# Altium project shepherd_v2.PrjPcb
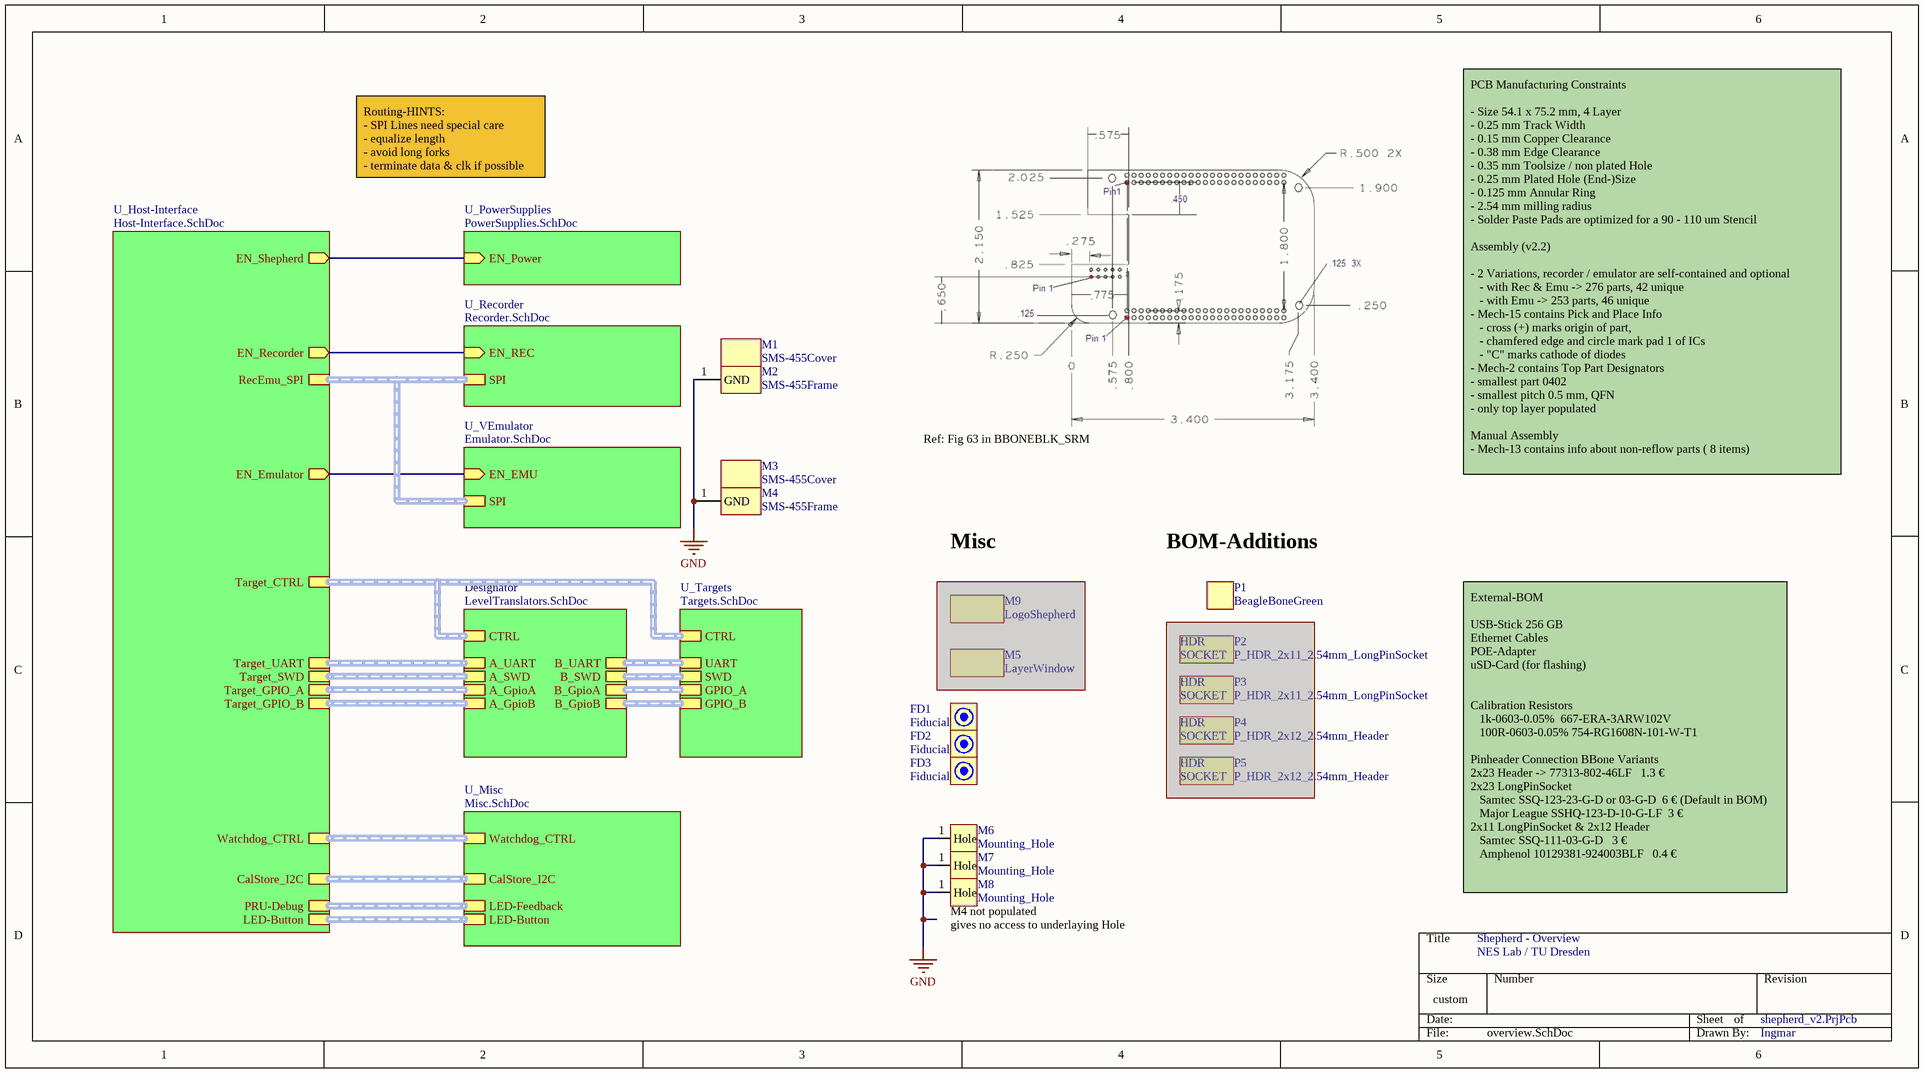
[diagram p0: overview.SchDoc]
3 sheets, 106 parts. Net scope: hierarchical (ports join the sheet entries above them; power ports are global).
Board file: shepherd_pcb_v2.2.PcbDoc
Sheets:
  overview.SchDoc
    U_Recorder = Recorder.SchDoc
    U_Targets = Targets.SchDoc

## Sheet overview.SchDoc: Shepherd - Overview
size 359 x 199 mm; Author: Ingmar; CompanyName: NES Lab / TU Dresden; Organization: NES Lab / TU Dresden; DocumentNumber: 1; SheetNumber: 1; SheetTotal: 8

### Parts
FD1  Fiducial  [M_Fiducial_3mm]  (no BOM)
FD2  Fiducial  [M_Fiducial_3mm]  (no BOM)
FD3  Fiducial  [M_Fiducial_3mm]  (no BOM)
M1  SMS-455Cover  (mechanical)
M2  SMS-455Frame  [SMS-455F]
M3  SMS-455Cover  (mechanical)
M4  SMS-455Frame  [SMS-455F]
M5  LayerWindow  [LayerWindow_4L_EC_conform_B]  (no BOM)  (masked out: inside a compile mask, not in the netlist)
M6  Mounting_Hole  [M_Mountinghole_3.2mm]  (no BOM)
M7  Mounting_Hole  [M_Mountinghole_3.2mm_min]  (no BOM)
M8  Mounting_Hole  [M_Mountinghole_3.2mm_min]  (no BOM)
M9  LogoShepherd  [LogoShepherd]  (no BOM)  (masked out: inside a compile mask, not in the netlist)
P1  BeagleBoneGreen  (mechanical)
P2  P_HDR_2x11_2.54mm_LongPinSocket  (mechanical)  (masked out: inside a compile mask, not in the netlist)
P3  P_HDR_2x11_2.54mm_LongPinSocket  (mechanical)  (masked out: inside a compile mask, not in the netlist)
P4  P_HDR_2x12_2.54mm_Header  (mechanical)  (masked out: inside a compile mask, not in the netlist)
P5  P_HDR_2x12_2.54mm_Header  (mechanical)  (masked out: inside a compile mask, not in the netlist)

### Sub-sheets
Designator = LevelTranslators.SchDoc (file not in this document): CTRL (harness GPIO), A_GpioA (harness GPIO), B_GpioA (harness GPIO), A_UART (harness UART), A_GpioB (harness GPIO), B_SWD (harness SWD), B_UART (harness UART), B_GpioB (harness GPIO), A_SWD (harness SWD)
U_Host-Interface = Host-Interface.SchDoc (file not in this document): RecEmu_SPI (harness SPI), Target_UART (harness UART), Target_SWD (harness SWD), CalStore_I2C (harness I2C), PRU-Debug (harness GPIO), Watchdog_CTRL (harness Watchdog), EN_Shepherd (out), LED-Button (harness GPIO), Target_CTRL (harness GPIO), Target_GPIO_A (harness GPIO), Target_GPIO_B (harness GPIO), EN_Recorder (out), EN_Emulator (out)
U_Misc = Misc.SchDoc (file not in this document): CalStore_I2C (harness I2C), LED-Feedback (harness GPIO), Watchdog_CTRL (harness Watchdog), LED-Button (harness GPIO)
U_PowerSupplies = PowerSupplies.SchDoc (file not in this document): EN_Power (in)
U_Recorder = Recorder.SchDoc: SPI (harness SPI), EN_REC (in)
U_Targets = Targets.SchDoc: UART (harness UART), SWD (harness SWD), CTRL (harness GPIO), GPIO_A (harness GPIO), GPIO_B (harness GPIO)
U_VEmulator = Emulator.SchDoc (file not in this document): SPI (harness SPI), EN_EMU (in)

### Nets
GND: M2.1(GND) M4.1(GND) M6.1(Hole) M7.1(Hole) M8.1(Hole)
~{RST}_rADC: sheet U_Host-Interface/EN_Recorder, sheet U_Recorder/EN_REC
(unnamed): sheet U_Host-Interface/EN_Shepherd, sheet U_PowerSupplies/EN_Power
(unnamed): sheet U_Host-Interface/EN_Emulator, sheet U_VEmulator/EN_EMU

### Buses and harness runs
harness sheet Designator/A_GpioA = sheet U_Host-Interface/Target_GPIO_A
harness sheet Designator/A_GpioB = sheet U_Host-Interface/Target_GPIO_B
harness sheet Designator/A_SWD = sheet U_Host-Interface/Target_SWD
harness sheet Designator/A_UART = sheet U_Host-Interface/Target_UART
harness sheet Designator/B_GpioA = sheet U_Targets/GPIO_A
harness sheet Designator/B_GpioB = sheet U_Targets/GPIO_B
harness sheet Designator/B_SWD = sheet U_Targets/SWD
harness sheet Designator/B_UART = sheet U_Targets/UART
harness sheet Designator/CTRL = sheet U_Host-Interface/Target_CTRL = sheet U_Targets/CTRL
harness sheet U_Host-Interface/CalStore_I2C = sheet U_Misc/CalStore_I2C
harness sheet U_Host-Interface/LED-Button = sheet U_Misc/LED-Button
harness sheet U_Host-Interface/PRU-Debug = sheet U_Misc/LED-Feedback
harness sheet U_Host-Interface/RecEmu_SPI = sheet U_Recorder/SPI = sheet U_VEmulator/SPI
harness sheet U_Host-Interface/Watchdog_CTRL = sheet U_Misc/Watchdog_CTRL

### Notes on the sheet
- Routing-HINTS:
  - SPI Lines need special care
  - equalize length
  - avoid long forks
  - terminate data & clk if possible
- Ref: Fig 63 in BBONEBLK_SRM
- PCB Manufacturing Constraints
  - Size 54.1 x 75.2 mm, 4 Layer
  - 0.25 mm Track Width
  - 0.15 mm Copper Clearance
  - 0.38 mm Edge Clearance
  - 0.35 mm Toolsize / non plated Hole
  - 0.25 mm Plated Hole (End-)Size
  - 0.125 mm Annular Ring
  - 2.54 mm milling radius
  - Solder Paste Pads are optimized for a 90 - 110 um Stencil
  Assembly (v2.2)
  - 2 Variations, recorder / emulator are self-contained and optional
  - with Rec & Emu -> 276 parts, 42 unique
  - with Emu -> 253 parts, 46 unique
  - Mech-15 contains Pick and Place Info
  - cross (+) marks origin of part,
  - chamfered edge and circle mark pad 1 of ICs
  - "C" marks cathode of diodes
  - Mech-2 contains Top Part Designators
  - smallest part 0402
  - smallest pitch 0.5 mm, QFN
  - only top layer populated
  Manual Assembly
  - Mech-13 contains info about non-reflow parts ( 8 items)
- Misc
- BOM-Additions
- External-BOM
  USB-Stick 256 GB
  Ethernet Cables
  POE-Adapter
  uSD-Card (for flashing)
  Calibration Resistors
  1k-0603-0.05% 	667-ERA-3ARW102V
  100R-0603-0.05%	754-RG1608N-101-W-T1
  Pinheader Connection BBone Variants
  2x23 Header -> 77313-802-46LF   1.3 €
  2x23 LongPinSocket
  Samtec SSQ-123-23-G-D or 03-G-D  6 € (Default in BOM)
  Major League SSHQ-123-D-10-G-LF  3 €
  2x11 LongPinSocket & 2x12 Header
  Samtec SSQ-111-03-G-D   3 €
  Amphenol 10129381-924003BLF   0.4 €
- (near M8) gives no access to underlaying Hole
- (near M8) M4 not populated
- (in symbol .P_HDR_2x11_2.54mm_LongPinSocket) HDR; SOCKET
- (in symbol .P_HDR_2x12_2.54mm_Header) HDR; SOCKET

### Library data of the parts
M1 M3 = SMS-455Cover: EMI-Shield Cover, SMT, .75"x.75", 18x18mm, Height 5.08 mm, ~40-70 dB; Manufacturer: LeaderTech; Manufacturer PN: SMS-455-N-C; Distributer: Mouser; Distributer PN: 861-SMS-455-N-C; Price n10 [€]: 0.34
M2 M4 = SMS-455Frame: EMI-Shield Frame, SMT, .75"x.75", 18x18mm, Height 5.08 mm, ~40-70 dB; Manufacturer: LeaderTech; Manufacturer PN: SMS-455-N-F; Distributer: Mouser; Distributer PN: 861-SMS-455-N-F; Price n10 [€]: 1.87
P1 = BeagleBoneGreen: Manufacturer: Seeed Studio; Manufacturer PN: 102010027; Distributer: RS-Online; Distributer PN: 174-3279; Price n10 [€]: 39.19
P2 P3 = .P_HDR_2x11_2.54mm_LongPinSocket: 10 mm Tail length; Manufacturer: Samtec; Manufacturer PN: SSQ-111-03-G-D; I_max: 6.3; Distributer: Mouser; Distributer PN: 200-SSQ11103GD; Price n10 [€]: 2.82
P4 P5 = .P_HDR_2x12_2.54mm_Header: Manufacturer: Amphenol FCI; Manufacturer PN: 10129381-924003BLF; I_max: 3A; V_max: 110V; Distributer: Mouser; Distributer PN: 649-1012938192403BLF; Price n10 [€]: 0.39

## Sheet Recorder.SchDoc: Shepherd - Recorder
size A3; Author: Kai; CompanyName: NES Lab / TU Dresden; DrawnBy: Ingmar; DocumentNumber: 4; SheetNumber: 4; SheetTotal: 8
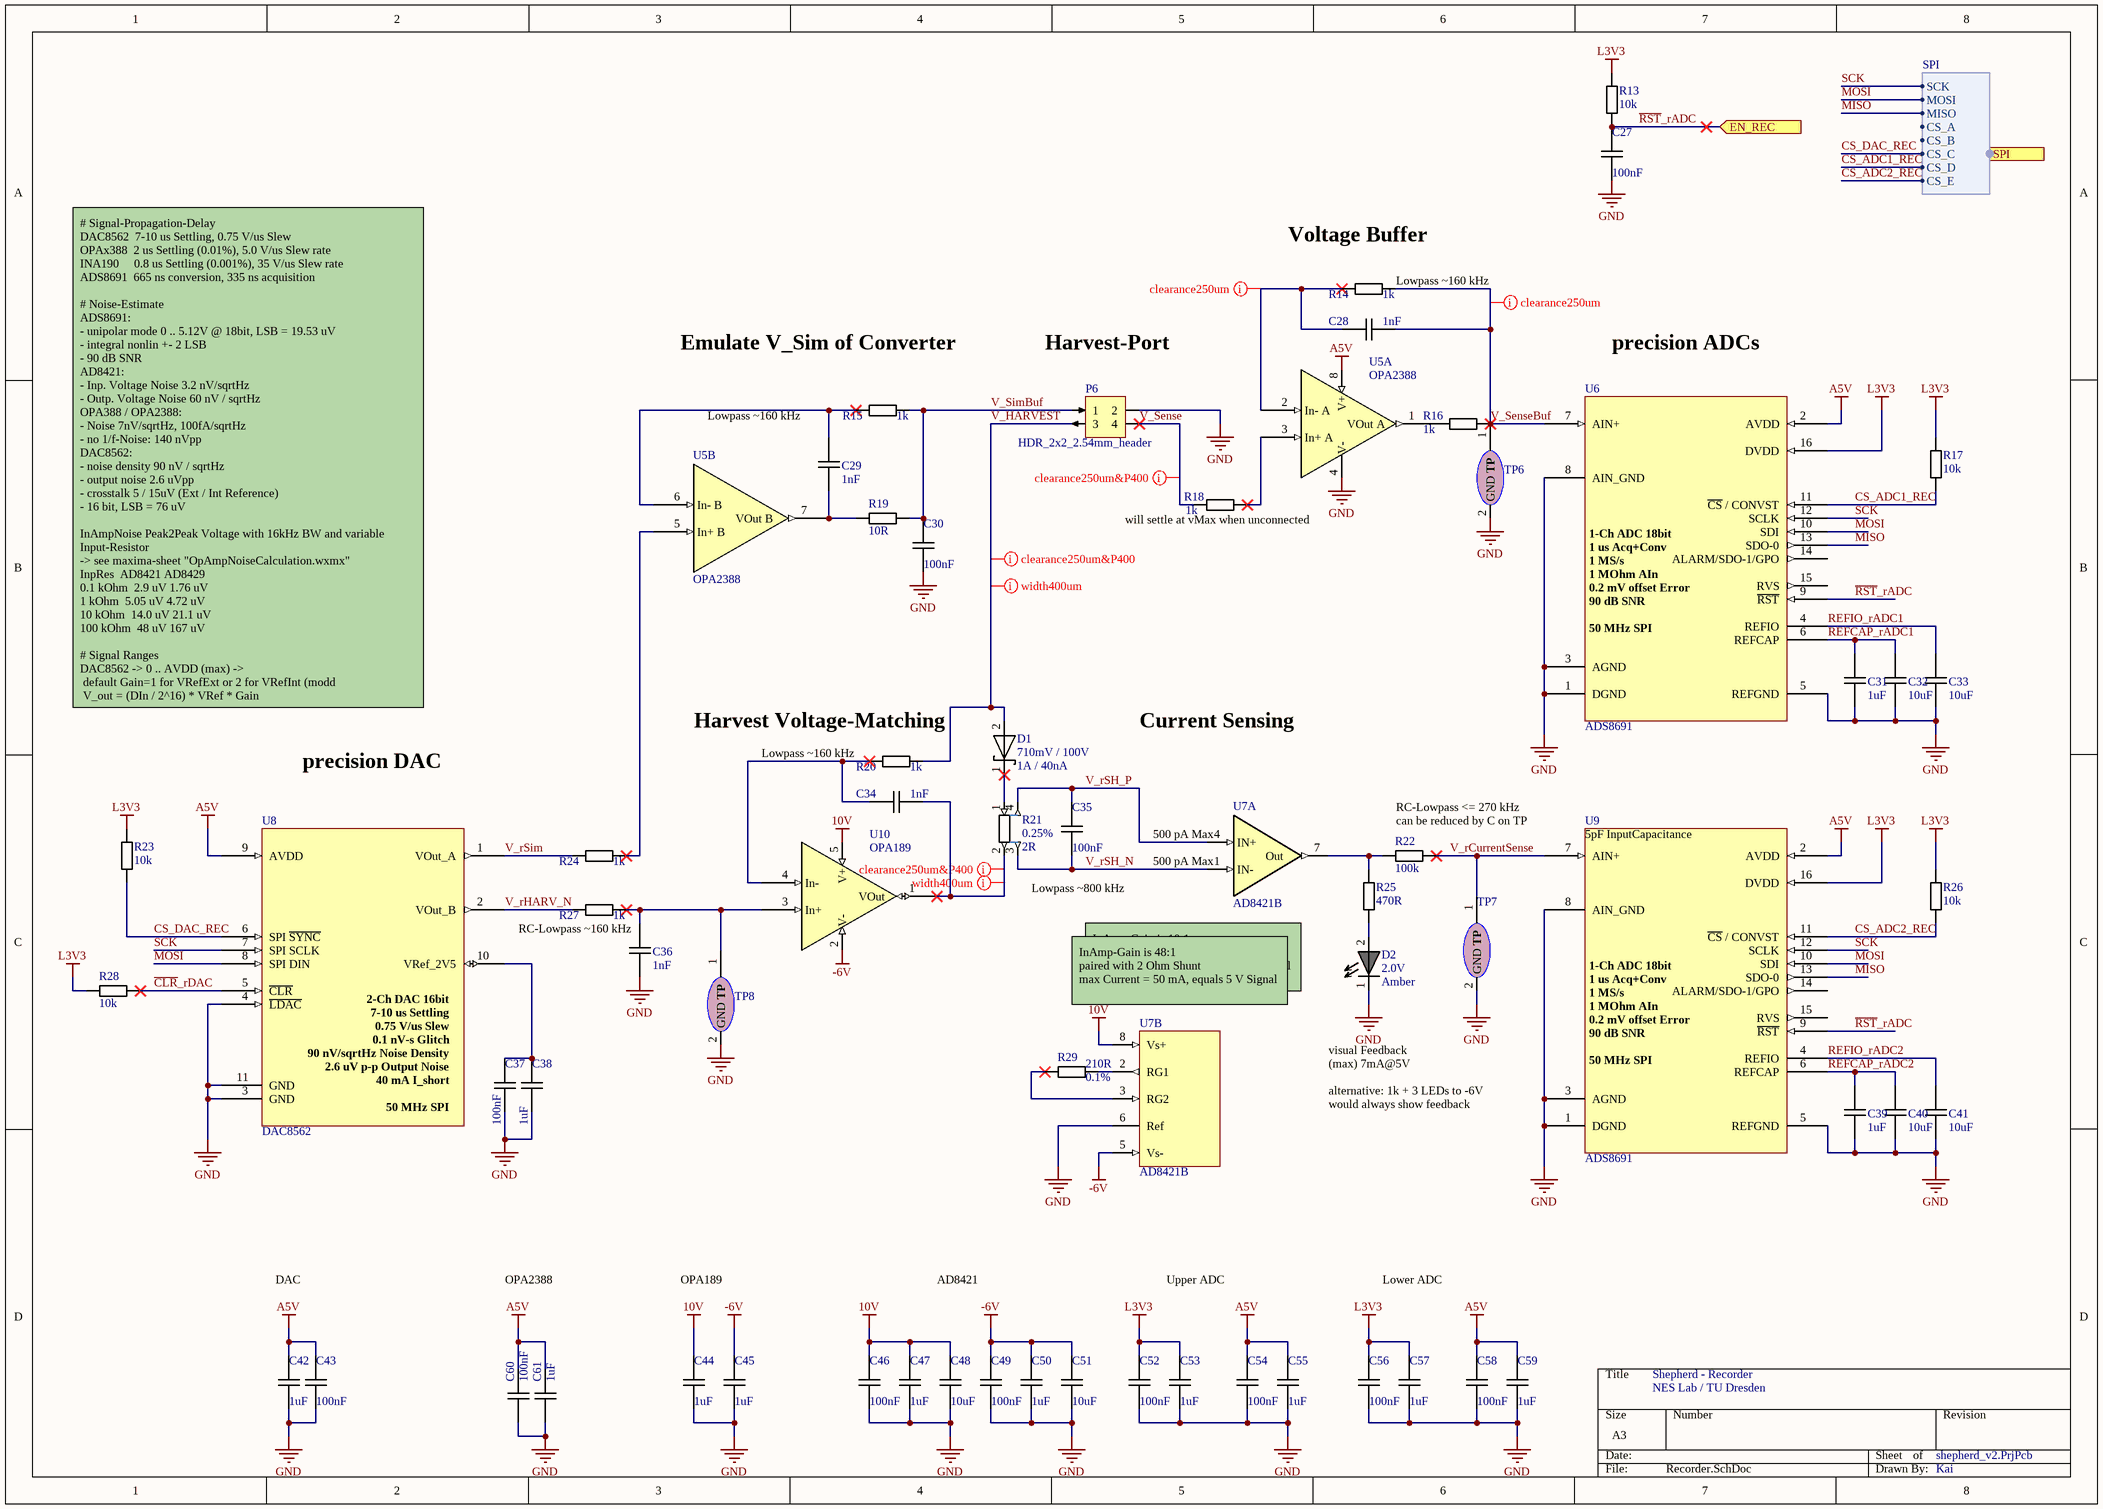
[diagram p1: Recorder.SchDoc]

### Parts
C27  value 100nF  [CAPC1005X06]  (hidden comment: C_0402_100nF_16V)
C28  value 1nF  [CAPC1005X06]  (hidden comment: C_0402_1nF_50V)
C29  value 1nF  [CAPC1005X06]  (hidden comment: C_0402_1nF_50V)
C30  value 100nF  [CAPC1005X06]  (hidden comment: C_0402_100nF_16V)
C31  value 1uF  [CAPC1005X06]  (hidden comment: C_0402_1uF_25V)
C32  value 10uF  [CAPC1608X09]  (hidden comment: C_0603_10uF_16V)
C33  value 10uF  [CAPC1608X09]  (hidden comment: C_0603_10uF_16V)
C34  value 1nF  [CAPC1005X06]  (hidden comment: C_0402_1nF_50V)
C35  value 100nF  [CAPC1005X06]  (hidden comment: C_0402_100nF_16V)
C36  value 1nF  [CAPC1005X06]  (hidden comment: C_0402_1nF_50V)
C37  value 100nF  [CAPC1005X06]  (hidden comment: C_0402_100nF_16V)
C38  value 1uF  [CAPC1005X06]  (hidden comment: C_0402_1uF_25V)
C39  value 1uF  [CAPC1005X06]  (hidden comment: C_0402_1uF_25V)
C40  value 10uF  [CAPC1608X09]  (hidden comment: C_0603_10uF_16V)
C41  value 10uF  [CAPC1608X09]  (hidden comment: C_0603_10uF_16V)
C42  value 1uF  [CAPC1005X06]  (hidden comment: C_0402_1uF_25V)
C43  value 100nF  [CAPC1005X06]  (hidden comment: C_0402_100nF_16V)
C44  value 1uF  [CAPC1005X06]  (hidden comment: C_0402_1uF_25V)
C45  value 1uF  [CAPC1005X06]  (hidden comment: C_0402_1uF_25V)
C46  value 100nF  [CAPC1005X06]  (hidden comment: C_0402_100nF_16V)
C47  value 1uF  [CAPC1005X06]  (hidden comment: C_0402_1uF_25V)
C48  value 10uF  [CAPC1608X09]  (hidden comment: C_0603_10uF_16V)
C49  value 100nF  [CAPC1005X06]  (hidden comment: C_0402_100nF_16V)
C50  value 1uF  [CAPC1005X06]  (hidden comment: C_0402_1uF_25V)
C51  value 10uF  [CAPC1608X09]  (hidden comment: C_0603_10uF_16V)
C52  value 100nF  [CAPC1005X06]  (hidden comment: C_0402_100nF_16V)
C53  value 1uF  [CAPC1005X06]  (hidden comment: C_0402_1uF_25V)
C54  value 100nF  [CAPC1005X06]  (hidden comment: C_0402_100nF_16V)
C55  value 1uF  [CAPC1005X06]  (hidden comment: C_0402_1uF_25V)
C56  value 100nF  [CAPC1005X06]  (hidden comment: C_0402_100nF_16V)
C57  value 1uF  [CAPC1005X06]  (hidden comment: C_0402_1uF_25V)
C58  value 100nF  [CAPC1005X06]  (hidden comment: C_0402_100nF_16V)
C59  value 1uF  [CAPC1005X06]  (hidden comment: C_0402_1uF_25V)
C60  value 100nF  [CAPC1005X06]  (hidden comment: C_0402_100nF_16V)
C61  value 1uF  [CAPC1005X06]  (hidden comment: C_0402_1uF_25V)
D1  value 710mV / 100V  I_max: 1A / 40nA  [SODFL350X110-2N]  (hidden comment: D_SOD123W_710mV_1A)
D2  value Amber  V_max: 2.0V  [DIOM1608X02N Orange]  (hidden comment: D_LED_0603_Amber)
P6  HDR_2x2_2.54mm_header  [P_Pinheader_2x2_R2.54mm]
R13  value 10k  [RESC1005X04]  (hidden comment: R_0402_10k)
R14  value 1k  [RESC1005X04]  (hidden comment: R_0402_1k)
R15  value 1k  [RESC1005X04]  (hidden comment: R_0402_1k)
R16  value 1k  [RESC1005X04]  (hidden comment: R_0402_1k)
R17  value 10k  [RESC1005X04]  (hidden comment: R_0402_10k)
R18  value 1k  [RESC1005X04]  (hidden comment: R_0402_1k)
R19  value 10R  [RESC1005X04]  (hidden comment: R_0402_10R)
R20  value 1k  [RESC1005X04]  (hidden comment: R_0402_1k)
R21  value 2R  Tolerance: 0.25%  [RESC3116X06 Shunt]  (hidden comment: R_1206_2R_0.25%)
R22  value 100k  [RESC1005X04]  (hidden comment: R_0402_100k_1%)
R23  value 10k  [RESC1005X04]  (hidden comment: R_0402_10k)
R24  value 1k  [RESC1005X04]  (hidden comment: R_0402_1k)
R25  value 470R  [RESC1005X04]  (hidden comment: R_0402_470R)
R26  value 10k  [RESC1005X04]  (hidden comment: R_0402_10k)
R27  value 1k  [RESC1005X04]  (hidden comment: R_0402_1k)
R28  value 10k  [RESC1005X04]  (hidden comment: R_0402_10k)
R29  value 210R  Tolerance: 0.1%  [RESC1005X04]  (hidden comment: R_0402_210R_0.1%)
TP6  Testpoint  [P_Testpins_Precision]  (value not drawn)  (no BOM)
TP7  Testpoint  [P_Testpins_Precision]  (value not drawn)  (no BOM)
TP8  Testpoint  [P_Testpins_Precision]  (value not drawn)  (no BOM)
U5  OPA2388  [TSOP65P490X110-8N]  (parts A,B of 2)
U6  ADS8691  [TSOP65P640X120-16N]
U7  AD8421B  [TSOP65P490X110-8N]  (parts A,B of 2)
U8  DAC8562  [PSON50P300X80_HS-11N]
U9  ADS8691  [TSOP65P640X120-16N]
U10  OPA189  [SOT95P280X145-5N]

### Ports
EN_REC (in), SPI (in, harness SPI)

### Harnesses
SPI: SCK, MOSI, MISO, CS_A, CS_B, CS_C, CS_D, CS_E

### Nets
10V: C44.2 C46.2 C47.2 C48.2 U7.8(Vs+) U10.5(V+)
-6V: C45.2 C49.2 C50.2 C51.2 U7.5(Vs-) U10.2(V-)
A5V: C42.2 C43.2 C54.2 C55.2 C58.2 C59.2 C60.2 C61.2 U5.8(V+) U6.2(AVDD) U8.9(AVDD) U9.2(AVDD)
GND: C27.1 C30.2 C31.1 C32.1 C33.1 C36.1 C37.1 C38.1 C39.1 C40.1 C41.1 C42.1 C43.1 C44.1 C45.1 C46.1 C47.1 C48.1 C49.1 C50.1 C51.1 C52.1 C53.1 C54.1 C55.1 C56.1 C57.1 C58.1 C59.1 C60.1 C61.1 D2.1 P6.2 TP6.2(GND) TP7.2(GND) TP8.2(GND) U5.4(V-) U6.1(DGND) U6.3(AGND) U6.5(REFGND) U6.8(AIN_GND) U7.6(Ref) U8.3(GND) U8.4(~{LDAC}) U8.11(GND) U9.1(DGND) U9.3(AGND) U9.5(REFGND) U9.8(AIN_GND)
L3V3: C52.2 C53.2 C56.2 C57.2 R13.1 R17.2 R23.2 R26.2 R28.2 U6.16(DVDD) U9.16(DVDD)
~{CLR}_rDAC: R28.1 U8.5(~{CLR})  [project net ~{CLR}_rDAC_4]
CS_ADC1_REC: R17.1 U6.11(~{CS}_/_CONVST) ; port SPI.CS_D
CS_ADC2_REC: R26.1 U9.11(~{CS}_/_CONVST) ; port SPI.CS_E
CS_DAC_REC: R23.1 U8.6(SPI_~{SYNC}) ; port SPI.CS_C
MISO: U6.13(SDO-0) U9.13(SDO-0) ; port SPI.MISO
MOSI: U6.10(SDI) U8.8(SPI_DIN) U9.10(SDI) ; port SPI.MOSI
~{RST}_rADC: C27.2 R13.2 U6.9(~{RST}) U9.9(~{RST}) ; port EN_REC
REFCAP_rADC1: C31.2 C32.2 U6.6(REFCAP)  [project net REFCAP_rADC1_4]
REFCAP_rADC2: C39.2 C40.2 U9.6(REFCAP)  [project net REFCAP_rADC2_4]
REFIO_rADC1: C33.2 U6.4(REFIO)  [project net REFIO_rADC1_4]
REFIO_rADC2: C41.2 U9.4(REFIO)  [project net REFIO_rADC2_4]
SCK: U6.12(SCLK) U8.7(SPI_SCLK) U9.12(SCLK) ; port SPI.SCK
V_HARVEST: D1.2 P6.3 R20.2  [project net V_HARVEST_4]
V_rCurrentSense: R22.2 TP7.1(TP) U9.7(AIN+)  [project net V_rCurrentSense_4]
V_rHARV_N: R27.1 U8.2(VOut_B)  [project net V_rHARV_N_4]
V_rSH_N: C35.1 R21.3 U7.1(IN-)  [project net V_rSH_N_4]
V_rSH_P: C35.2 R21.4 U7.4(IN+)  [project net V_rSH_P_4]
V_rSim: R24.1 U8.1(VOut_A)  [project net V_rSim_4]
V_Sense: P6.4 R18.1  [project net V_Sense_4]
V_SenseBuf: C28.2 R14.2 R16.2 TP6.1(TP) U6.7(AIN+)  [project net V_SenseBuf_4]
V_SimBuf: C30.1 P6.1 R15.2 R19.2  [project net V_SimBuf_4]
NetC28_1: C28.1 R14.1 U5.2(In-_A)
NetC29_1: C29.1 R19.1 U5.7(VOut_B)
NetC29_2: C29.2 R15.1 U5.6(In-_B)
NetC34_1: C34.1 R21.2 U10.1(VOut)
NetC34_2: C34.2 R20.1 U10.4(In-)
NetC36_2: C36.2 R27.2 TP8.1(TP) U10.3(In+)
NetC37_2: C37.2 C38.2 U8.10(VRef_2V5)
NetD1_1: D1.1 R21.1
NetD2_2: D2.2 R25.1
NetR16_1: R16.1 U5.1(VOut_A)
NetR18_2: R18.2 U5.3(In+_A)
NetR22_1: R22.1 R25.2 U7.7(Out)
NetR24_2: R24.2 U5.5(In+_B)
NetR29_1: R29.1 U7.3(RG2)
NetR29_2: R29.2 U7.2(RG1)

Not connected (* = marked no-connect by the designer): U6 14(ALARM/SDO-1/GPO) 15(RVS); U9 14(ALARM/SDO-1/GPO) 15(RVS)

### Layout directives
rule Width Constraint [Pref Width = 0.4mm    Min Width = 0.4mm    Max Width = 1mm]: NetC34_1, V_HARVEST_4
rule Clearance Constraint [Clearance = 0.25mm]: NetC28_1, V_SenseBuf_4
rule Clearance Constraint [Generic clearance = 0.25mm, and 7 value(s) for objects]: V_HARVEST_4, V_Sense_4
rule Clearance Constraint [Generic clearance = 0.25mm, and 17 value(s) for objects]: NetC34_1

### Notes on the sheet
- (near R14) Voltage Buffer
- (near R14) Lowpass ~160 kHz
- Emulate V_Sim of Converter
- Harvest-Port
- precision ADCs
- Lowpass ~160 kHz
- (near R18) will settle at vMax when unconnected
- # Signal-Propagation-Delay
  DAC8562  7-10 us Settling, 0.75 V/us Slew
  OPAx388  2 us Settling (0.01%), 5.0 V/us Slew rate
  INA190     0.8 us Settling (0.001%), 35 V/us Slew rate
  ADS8691  665 ns conversion, 335 ns acquisition
  # Noise-Estimate
  ADS8691:
  - unipolar mode 0 .. 5.12V @ 18bit, LSB = 19.53 uV
  - integral nonlin +- 2 LSB
  - 90 dB SNR
  AD8421:
  - Inp. Voltage Noise 3.2 nV/sqrtHz
  - Outp. Voltage Noise 60 nV / sqrtHz
  OPA388 / OPA2388:
  - Noise 7nV/sqrtHz, 100fA/sqrtHz
  - no 1/f-Noise: 140 nVpp
  DAC8562:
  - noise density 90 nV / sqrtHz
  - output noise 2.6 uVpp
  - crosstalk 5 / 15uV (Ext / Int Reference)
  - 16 bit, LSB = 76 uV
  InAmpNoise Peak2Peak Voltage with 16kHz BW and variable Input-Resistor
  -> see maxima-sheet "OpAmpNoiseCalculation.wxmx"
  InpRes		AD8421	AD8429
  0.1 kOhm		2.9 uV	1.76 uV
  1 kOhm		5.05 uV	4.72 uV
  10 kOhm		14.0 uV	21.1 uV
  100 kOhm		48 uV	167 uV
  # Signal Ranges
  DAC8562 -> 0 .. AVDD (max) ->
  default Gain=1 for VRefExt or 2 for VRefInt (modd
  V_out = (DIn / 2^16) * VRef * Gain
  OPA388
- precision DAC
- (near R20) Harvest Voltage-Matching
- (near R20) Lowpass ~160 kHz
- Current Sensing
- (near U7) 500 pA Max
- (near R22) RC-Lowpass <= 270 kHz
- (near R22) can be reduced by C on TP
- (near U9) 5pF InputCapacitance
- Lowpass ~800 kHz
- RC-Lowpass ~160 kHz
- InAmp-Gain is 10:1
  paired with 10 Ohm Shunt
  max Current = 50 mA, equals 5 V Signal
- (near U7) InAmp-Gain is 48:1
  paired with 2 Ohm Shunt
  max Current = 50 mA, equals 5 V Signal
- visual Feedback
- (max) 7mA@5V
- alternative: 1k + 3 LEDs to -6V
- would always show feedback
- DAC
- OPA2388
- OPA189
- AD8421
- Upper ADC
- Lower ADC
- (in symbol ADS8691) 1-Ch ADC 18bit / 1 us Acq+Conv / 1 MS/s / 1 MOhm AIn / 0.2 mV offset Error / 90 dB SNR / 50 MHz SPI /
- (in symbol DAC8562-DSC) 2-Ch DAC 16bit / 7-10 us Settling / 0.75 V/us Slew / 0.1 nV-s Glitch / 90 nV/sqrtHz Noise Density / 2.6 uV p-p Output Noise / 40 mA I_short / 50 MHz SPI

### Library data of the parts
C27 C30 C35 C37 C43 C46 C49 C52 C54 C56 C58 C60 = .C_0402_100nF_16V: Capacitor; Manufacturer: Taiyo Yuden; Manufacturer PN: EMF105B7104MVHF; V_max: 16V; Tolerance: 20%; Dielectric: X7R; Distributer: Mouser; Distributer PN: 963-EMF105B7104MVHF; Price n10 [€]: 0.03
C28 C29 C34 C36 = .C_0402_1nF_50V: Capacitor; Manufacturer: Murata; Manufacturer PN: GRM1555C1H102JA01D; V_max: 50V; Tolerance: 5%; Dielectric: C0G; Distributer: Mouser; Distributer PN: 81-GRM1555C1H102JA1D; Price n10 [€]: 0.02
C31 C38 C39 C42 C44 C45 C47 C50 C53 C55 C57 C59 C61 = .C_0402_1uF_25V: Capacitor; Manufacturer: Murata; Manufacturer PN: GRM155R61E105KA12J; V_max: 25V; Tolerance: 10%; Dielectric: X5R; Distributer: Mouser; Distributer PN: 81-GRM155R61E105KA2J; Price n10 [€]: 0.06
C32 C33 C40 C41 C48 C51 = .C_0603_10uF_16V: Capacitor; Manufacturer: Taiyo Yuden; Manufacturer PN: EMK107BBJ106MA-T; V_max: 16V; Tolerance: 20%; Dielectric: X5R; Distributer: Mouser; Distributer PN: 963-EMK107BBJ106MA-T; Price n10 [€]: 0.14
D1 = .D_SOD123W_710mV_1A: Diode Si, 710mV 1A forward, 100V 40nA reverse, 50A Surge,; Manufacturer: Nexperia; Manufacturer PN: PMEG10010ELRX; Distributer: Mouser; Distributer PN: 771-PMEG10010ELRX; Price n10 [€]: 0.24
D2 = .D_LED_0603_Amber: LED Amber 610nm, 0603, 130 mcd, 2V@20mA; Manufacturer: Wuerth; Manufacturer PN: 150060AS75000; I_max: 20mA; I_typ: 5mA; V_typ: 1.9V; Distributer: Mouser; Distributer PN: 710-150060AS75000; Price n10 [€]: 0.12
P6 = .P_HDR_2x2_2.54mm_male: Gold, Straight, 5.80 mm Mating, 3.46 mm termination; Manufacturer: Amphenol; Manufacturer PN: 861400042YO2319LF; I_max: 3A; V_max: 1kV; Distributer: Mouser; Distributer PN: 649-86140042YO2319LF; Price n10 [€]: 0.12
R13 R17 R23 R26 R28 = .R_0402_10k: Resistor; Manufacturer: Panasonic; Manufacturer PN: ERJ-2GEJ103X; P_max: 100mW; V_max: 50V; Tolerance: 5%; Distributer: Mouser; Distributer PN: 667-ERJ-2GEJ103X; Price n10 [€]: 0.02
R14-R16 R18 R20 R24 R27 = .R_0402_1k: Resistor; Manufacturer: Panasonic; Manufacturer PN: ERJ-2GEJ102X; P_max: 100mW; V_max: 50V; Tolerance: 5%; Distributer: Mouser; Distributer PN: 667-ERJ-2GEJ102X; Price n10 [€]: 0.02
R19 = .R_0402_10R: Resistor; Manufacturer: Panasonic; Manufacturer PN: ERJ-2GEJ100X; P_max: 100mW; V_max: 50V; Tolerance: 5%; Distributer: Mouser; Distributer PN: 667-ERJ-2GEJ100X; Price n10 [€]: 0.02
R21 = .R_1206_2R_0.25%: Resistor 25 ppm/C; Manufacturer: Yageo; Manufacturer PN: RT1206CRD072RL; P_max: 250mW; V_max: 200V; Distributer: Mouser; Distributer PN: 603-RT1206CRD072RL; Price n10 [€]: 0.35
R22 = .R_0402_100k: Resistor; Manufacturer: Panasonic; Manufacturer PN: ERJ-2RKF1003X; P_max: 100mW; V_max: 50V; Tolerance: 1%; Distributer: Mouser; Distributer PN: 667-ERJ-2RKF1003X; Price n10 [€]: 0.02
R25 = .R_0402_470R: Resistor; Manufacturer: Panasonic; Manufacturer PN: ERJ-2GEJ471X; P_max: 100mW; V_max: 50V; Tolerance: 5%; Distributer: Mouser; Distributer PN: 667-ERJ-2GEJ471X; Price n10 [€]: 0.02
R29 = .R_0402_210R_0.1%: Resistor 25ppm/C; Manufacturer: Yageo; Manufacturer PN: RT0402BRD07210RL; P_max: 62mW; V_max: 50V; Distributer: Mouser; Distributer PN: 603-RT0402BRD07210RL; Price n10 [€]: 0.19
TP6-TP8 = Testpoint_Precision
U5 = OPA2388: OpAmp High Precision, 30-60 mA perm, 5 V/us Slew, 7 nV/sqrtHz NoiseDist, 0.25 uV Offset, Z_id 100 MOhm, Z_ic 60 TOhm; Manufacturer: TI; Manufacturer PN: OPA2388IDGKR; V_max: 5.5V; V_min: 2.5V; Distributer: Mouser; Distributer PN: 595-OPA2388IDGKR; Price n10 [€]: 2.63
U6 U9 = ADS8691: ADC, 1CH, 18 Bit, 1 MS/s, 50 MHz SPI, 335 ns Acq & 665 ns Conv; Manufacturer: TI; Manufacturer PN: ADS8691IPWR; V_max: 5.25V; V_min: 1.65V; Distributer: Mouser; Distributer PN: 595-ADS8691IPWR; Price n10 [€]: 8.5
U7 = AD8421B: Low Noise InAmp, / 134 dB CMRR @ G100, f60Hz / 0.1 % Gain Error / 10 ppm Gain NonLin / 65mA max Output; Manufacturer: Analog; Manufacturer PN: AD8421BRMZ; I_max: 2.3mA; V_max: 18V; V_min: 2.5V; Distributer: Mouser; Distributer PN: 584-AD8421BRMZ; Price n10 [€]: 8.10
U8 = DAC8562-DSC: DAC, 2 CH, 10 us Settling, 16 bit Res, 50 MHz SPI; Manufacturer: TI; Manufacturer PN: DAC8562SDSCR; V_max: 5.5V; V_min: 2.7V; Distributer: Mouser; Distributer PN: 595-DAC8562SDSCR; Price n10 [€]: 6.73
U10 = OPA189-DBV: OpAmp High Precision, +-65 mA perm, 20 V/us Slew, 5 nV/sqrtHz NoiseDist, Z_id 100 MOhm, Z_ic 60 TOhm, Iq ~ 1.7 mA; Manufacturer: TI; Manufacturer PN: OPA189IDBVR; V_max: 36V; V_min: 4.5V; Distributer: Mouser; Distributer PN: 595-OPA189IDBVR; Price n10 [€]: 2.02

## Sheet Targets.SchDoc: Shepherd - Target Interface
size A3; Author: Ingmar; CompanyName: NES Lab / TU Dresden; DocumentNumber: 7; SheetNumber: 7; SheetTotal: 8
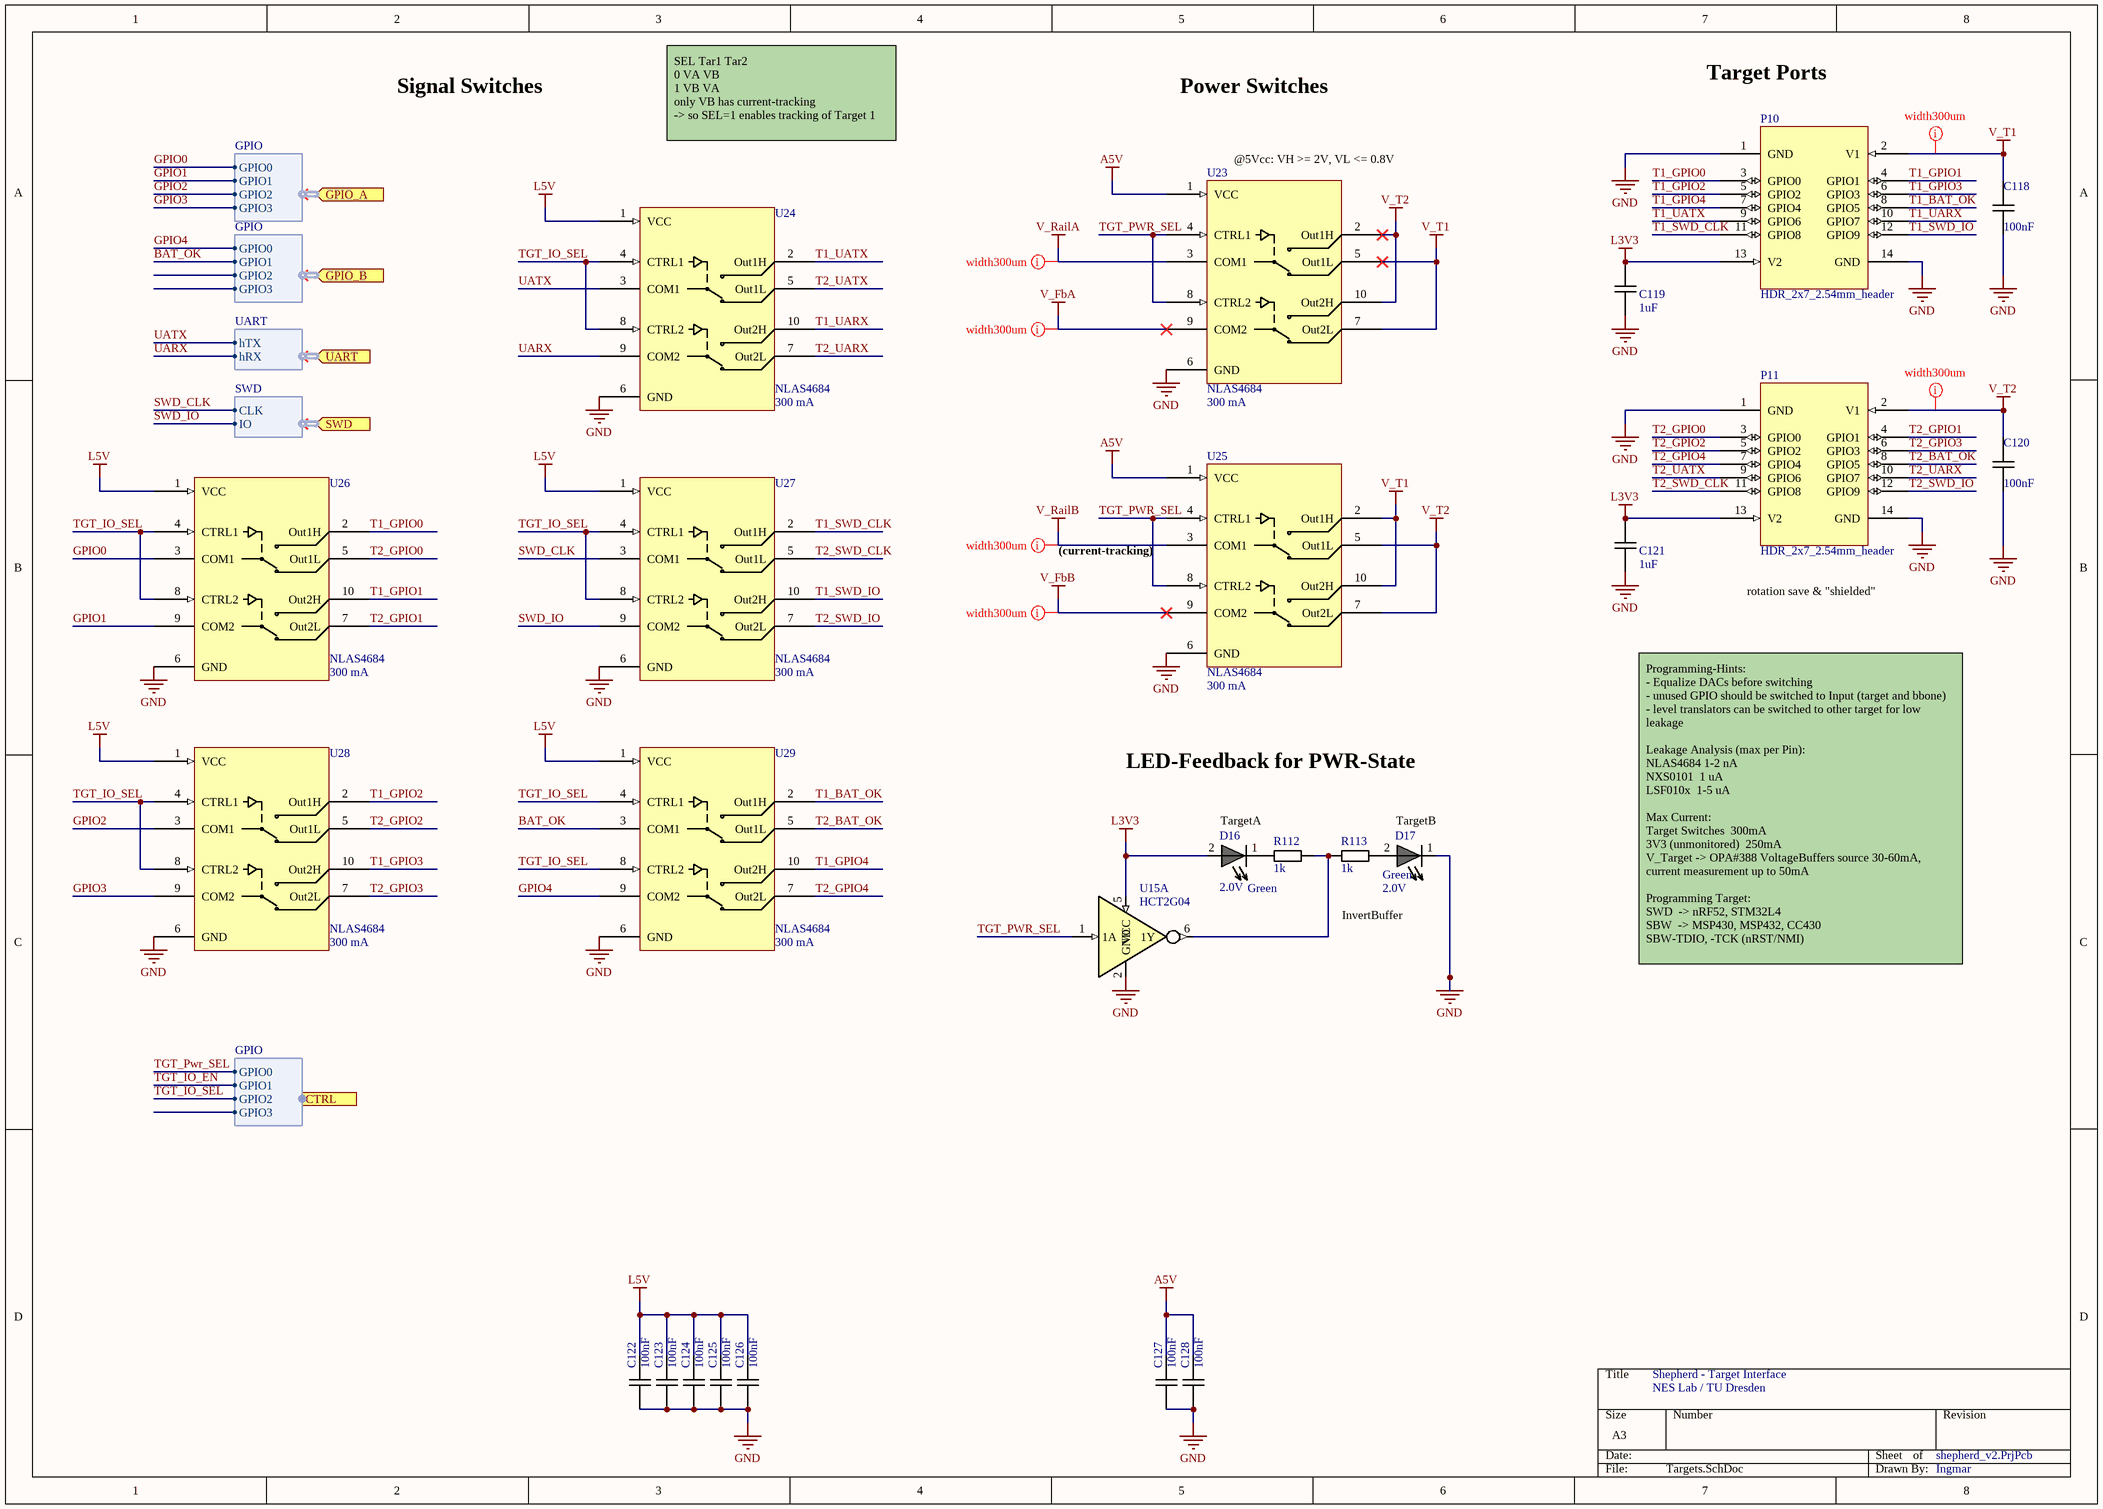
[diagram p2: Targets.SchDoc]

### Parts
C118  value 100nF  [CAPC1005X06]  (hidden comment: C_0402_100nF_16V)
C119  value 1uF  [CAPC1005X06]  (hidden comment: C_0402_1uF_25V)
C120  value 100nF  [CAPC1005X06]  (hidden comment: C_0402_100nF_16V)
C121  value 1uF  [CAPC1005X06]  (hidden comment: C_0402_1uF_25V)
C122  value 100nF  [CAPC1005X06]  (hidden comment: C_0402_100nF_16V)
C123  value 100nF  [CAPC1005X06]  (hidden comment: C_0402_100nF_16V)
C124  value 100nF  [CAPC1005X06]  (hidden comment: C_0402_100nF_16V)
C125  value 100nF  [CAPC1005X06]  (hidden comment: C_0402_100nF_16V)
C126  value 100nF  [CAPC1005X06]  (hidden comment: C_0402_100nF_16V)
C127  value 100nF  [CAPC1005X06]  (hidden comment: C_0402_100nF_16V)
C128  value 100nF  [CAPC1005X06]  (hidden comment: C_0402_100nF_16V)
D16  value Green  V_max: 2.0V  [DIOM1608X02N Green]  (hidden comment: D_LED_0603_Green)
D17  value Green  V_max: 2.0V  [DIOM1608X02N Green]  (hidden comment: D_LED_0603_Green)
P10  HDR_2x7_2.54mm_header  [P_Pinheader_2x7_R2.54mm_target]
P11  HDR_2x7_2.54mm_header  [P_Pinheader_2x7_R2.54mm_male]
R112  value 1k  [RESC1005X04]  (hidden comment: R_0402_1k)
R113  value 1k  [RESC1005X04]  (hidden comment: R_0402_1k)
U15  HCT2G04  [SOT65P210X110-6N]  (part A of 2)
U23  NLAS4684  I_max: 300 mA  [PSON50P300X100_HS-11N]
U24  NLAS4684  I_max: 300 mA  [PSON50P300X100_HS-11N]
U25  NLAS4684  I_max: 300 mA  [PSON50P300X100_HS-11N]
U26  NLAS4684  I_max: 300 mA  [PSON50P300X100_HS-11N]
U27  NLAS4684  I_max: 300 mA  [PSON50P300X100_HS-11N]
U28  NLAS4684  I_max: 300 mA  [PSON50P300X100_HS-11N]
U29  NLAS4684  I_max: 300 mA  [PSON50P300X100_HS-11N]

### Ports
CTRL (in, harness GPIO), GPIO_A (in, harness GPIO), GPIO_B (in, harness GPIO), SWD (in, harness SWD), UART (in, harness UART)

### Harnesses
GPIO: GPIO0, GPIO1, GPIO2, GPIO3
SWD: CLK, IO
UART: hTX, hRX

### Nets
A5V: C127.2 C128.2 U23.1(VCC) U25.1(VCC)
GND: C118.1 C119.1 C120.1 C121.1 C122.1 C123.1 C124.1 C125.1 C126.1 C127.1 C128.1 D17.1 P10.1(GND) P10.14(GND) P11.1(GND) P11.14(GND) U15.2(GND) U23.6(GND) U24.6(GND) U25.6(GND) U26.6(GND) U27.6(GND) U28.6(GND) U29.6(GND)
L3V3: C119.2 C121.2 D16.2 P10.13(V2) P11.13(V2) U15.5(VCC)
L5V: C122.2 C123.2 C124.2 C125.2 C126.2 U24.1(VCC) U26.1(VCC) U27.1(VCC) U28.1(VCC) U29.1(VCC)
V_FbA: U23.9(COM2)
V_FbB: U25.9(COM2)
V_RailA: U23.3(COM1)
V_RailB: U25.3(COM1)
V_T1: C118.2 P10.2(V1) U23.5(Out1L) U23.7(Out2L) U25.2(Out1H) U25.10(Out2H)
V_T2: C120.2 P11.2(V1) U23.2(Out1H) U23.10(Out2H) U25.5(Out1L) U25.7(Out2L)
BAT_OK: U29.3(COM1) ; port GPIO_B.GPIO1
GPIO0: U26.3(COM1) ; port GPIO_A.GPIO0
GPIO1: U26.9(COM2) ; port GPIO_A.GPIO1
GPIO2: U28.3(COM1) ; port GPIO_A.GPIO2
GPIO3: U28.9(COM2) ; port GPIO_A.GPIO3
GPIO4: U29.9(COM2) ; port GPIO_B.GPIO0
SWD_CLK: U27.3(COM1) ; port SWD.CLK
SWD_IO: U27.9(COM2) ; port SWD.IO
T1_BAT_OK: P10.8(GPIO5) U29.2(Out1H)  [project net T1_BAT_OK_7]
T1_GPIO0: P10.3(GPIO0) U26.2(Out1H)  [project net T1_GPIO0_7]
T1_GPIO1: P10.4(GPIO1) U26.10(Out2H)  [project net T1_GPIO1_7]
T1_GPIO2: P10.5(GPIO2) U28.2(Out1H)  [project net T1_GPIO2_7]
T1_GPIO3: P10.6(GPIO3) U28.10(Out2H)  [project net T1_GPIO3_7]
T1_GPIO4: P10.7(GPIO4) U29.10(Out2H)  [project net T1_GPIO4_7]
T1_SWD_CLK: P10.11(GPIO8) U27.2(Out1H)  [project net T1_SWD_CLK_7]
T1_SWD_IO: P10.12(GPIO9) U27.10(Out2H)  [project net T1_SWD_IO_7]
T1_UARX: P10.10(GPIO7) U24.10(Out2H)  [project net T1_UARX_7]
T1_UATX: P10.9(GPIO6) U24.2(Out1H)  [project net T1_UATX_7]
T2_BAT_OK: P11.8(GPIO5) U29.5(Out1L)  [project net T2_BAT_OK_7]
T2_GPIO0: P11.3(GPIO0) U26.5(Out1L)  [project net T2_GPIO0_7]
T2_GPIO1: P11.4(GPIO1) U26.7(Out2L)  [project net T2_GPIO1_7]
T2_GPIO2: P11.5(GPIO2) U28.5(Out1L)  [project net T2_GPIO2_7]
T2_GPIO3: P11.6(GPIO3) U28.7(Out2L)  [project net T2_GPIO3_7]
T2_GPIO4: P11.7(GPIO4) U29.7(Out2L)  [project net T2_GPIO4_7]
T2_SWD_CLK: P11.11(GPIO8) U27.5(Out1L)  [project net T2_SWD_CLK_7]
T2_SWD_IO: P11.12(GPIO9) U27.7(Out2L)  [project net T2_SWD_IO_7]
T2_UARX: P11.10(GPIO7) U24.7(Out2L)  [project net T2_UARX_7]
T2_UATX: P11.9(GPIO6) U24.5(Out1L)  [project net T2_UATX_7]
TGT_IO_EN: port CTRL.GPIO1
TGT_IO_SEL: U24.4(CTRL1) U24.8(CTRL2) U26.4(CTRL1) U26.8(CTRL2) U27.4(CTRL1) U27.8(CTRL2) U28.4(CTRL1) U28.8(CTRL2) U29.4(CTRL1) U29.8(CTRL2) ; port CTRL.GPIO2
TGT_PWR_SEL: U15.1(1A) U23.4(CTRL1) U23.8(CTRL2) U25.4(CTRL1) U25.8(CTRL2) ; port CTRL.GPIO0
UARX: U24.9(COM2) ; port UART.hRX
UATX: U24.3(COM1) ; port UART.hTX
NetD16_1: D16.1 R112.1
NetD17_2: D17.2 R113.1
NetR112_2: R112.2 R113.2 U15.6(1Y)

### Layout directives
rule Width Constraint [Pref Width = 0.3mm    Min Width = 0.3mm    Max Width = 1mm]: V_FbA, V_FbB, V_RailA, V_RailB, V_T1, V_T2

### Notes on the sheet
- Signal Switches
- Power Switches
- Target Ports
- SEL	Tar1	Tar2
  0	VA	VB
  1	VB	VA
  only VB has current-tracking
  -> so SEL=1 enables tracking of Target 1
- (near U23) @5Vcc: VH >= 2V, VL <= 0.8V
- (near U25) (current-tracking)
- rotation save & "shielded"
- LED-Feedback for PWR-State
- TargetA
- TargetB
- InvertBuffer
- Programming-Hints:
  - Equalize DACs before switching
  - unused GPIO should be switched to Input (target and bbone)
  - level translators can be switched to other target for low leakage
  Leakage Analysis (max per Pin):
  NLAS4684	1-2 nA
  NXS0101		1 uA
  LSF010x		1-5 uA
  Max Current:
  Target Switches 	300mA
  3V3 (unmonitored) 	250mA
  V_Target -> OPA#388 VoltageBuffers source 30-60mA, current measurement up to 50mA
  Programming Target:
  SWD 	-> nRF52, STM32L4
  SBW 	-> MSP430, MSP432, CC430
  SBW-TDIO, -TCK (nRST/NMI)

### Library data of the parts
C118 C120 C122-C128 = .C_0402_100nF_16V: as C27 on sheet Recorder; Distributer: Mouser; Distributer PN: 963-EMF105B7104MVHF; Price n10 [€]: 0.03
C119 C121 = .C_0402_1uF_25V: as C31 on sheet Recorder; Distributer: Mouser; Distributer PN: 81-GRM155R61E105KA2J; Price n10 [€]: 0.06
D16 D17 = .D_LED_0603_Green: LED YellowGreen 575nm, 0603, 60mcd 2V@20mA; Manufacturer: Wuerth; Manufacturer PN: 150060VS55040; I_max: 20mA; I_typ: 5mA; V_typ: 1.85V; Distributer: Mouser; Distributer PN: 710-150060VS55040; Price n10 [€]: 0.14
P10 P11 = .P_HDR_2x7_2.54mm_male: Gold, Straight; Manufacturer: Amphenol FCI; Manufacturer PN: 10129381-914004BLF; I_max: 3A; V_max: 110V; Distributer: Mouser; Distributer PN: 649-1012938191404BLF; Price n10 [€]: 0.19
R112 R113 = .R_0402_1k: as R14 on sheet Recorder; Distributer: Mouser; Distributer PN: 667-ERJ-2GEJ102X; Price n10 [€]: 0.02
U15 = HCT2G04: Inverter Dual, Buffered, I_out +- 25mA max,; Manufacturer: Nexperia; Manufacturer PN: 74HC2G04GW,125; V_max: 6.0V; V_min: 2.0V; I_max: 400uA; Distributer: Mouser; Distributer PN: 771-HC2G04GW125; Price n10 [€]: 0.21
U23-U29 = NLAS4684-MN: Analog Switch, Dual SPDT, 500 mOhm Rds, 300 mA continuous, 500 mA peak, <10 nA Leakage (1 nA for -55 to 25°C); Manufacturer: ON Semi; Manufacturer PN: NLAS4684MNR2G; V_max: 5.5; V_min: 1.8V; Distributer: Mouser; Distributer PN: 863-NLAS4684MNR2G; Price n10 [€]: 0.63

## Nets that join several sheets
A5V: Recorder (12 pins), Targets (C127.2 C128.2 U23.1 U25.1)
GND: overview (5 pins), Recorder (49 pins), Targets (24 pins)
L3V3: Recorder (11 pins), Targets (6 pins)

## Assembly variants
noRecorder: all parts fitted